# Altium project PCB_Project_1.PrjPcb
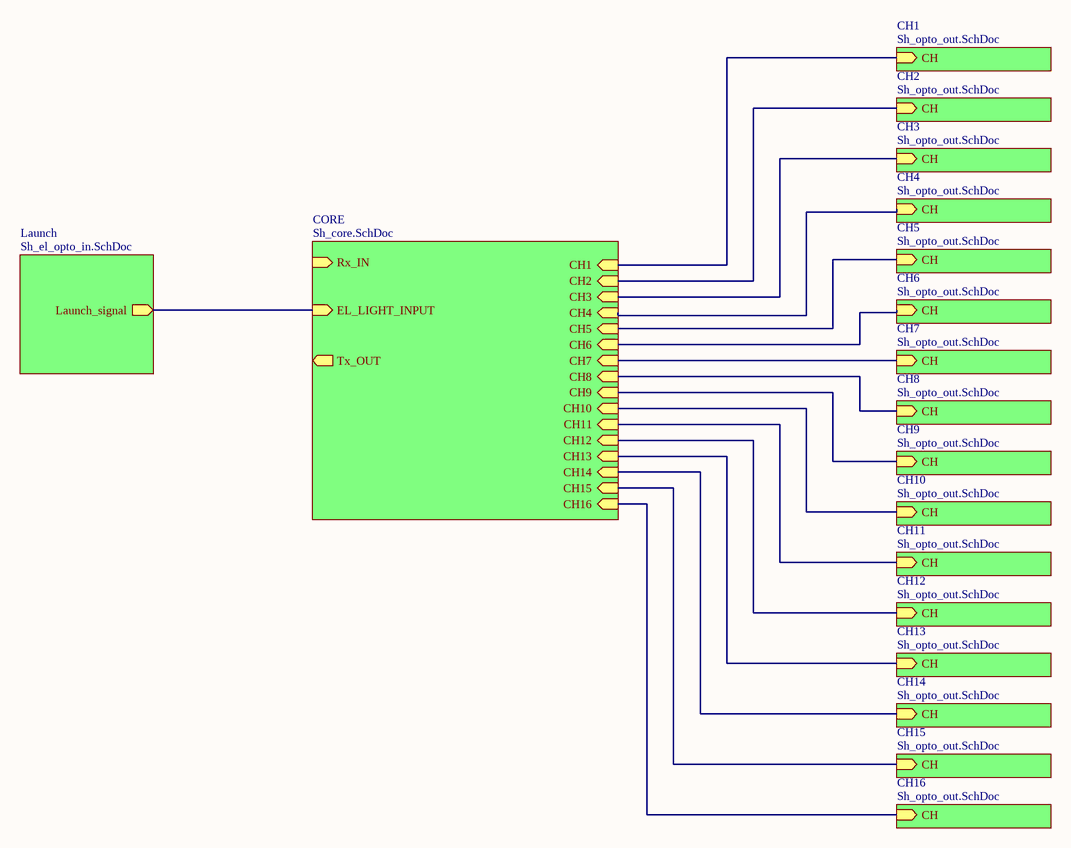
[diagram p0: Functional.SchDoc]
4 sheets, 127 parts. Net scope: hierarchical (ports join the sheet entries above them; power ports are global).
Board file: PCB2.PcbDoc
Sheets:
  Functional.SchDoc
    CORE = Sh_core.SchDoc
    CH1 = Sh_opto_out.SchDoc
    CH2 = Sh_opto_out.SchDoc
    CH3 = Sh_opto_out.SchDoc
    CH4 = Sh_opto_out.SchDoc
    CH5 = Sh_opto_out.SchDoc
    CH6 = Sh_opto_out.SchDoc
    CH7 = Sh_opto_out.SchDoc
    CH8 = Sh_opto_out.SchDoc
    CH9 = Sh_opto_out.SchDoc
    CH10 = Sh_opto_out.SchDoc
    CH11 = Sh_opto_out.SchDoc
    CH12 = Sh_opto_out.SchDoc
    CH13 = Sh_opto_out.SchDoc
    CH14 = Sh_opto_out.SchDoc
    CH15 = Sh_opto_out.SchDoc
    CH16 = Sh_opto_out.SchDoc
    Launch = Sh_el_opto_in.SchDoc

## Sheet Functional.SchDoc
size 420 x 297 mm; Address1: Address1; Address2: Address2; Address3: Address3; Address4: Address4; DocumentNumber: АБВГ.123456.001 Э3; SheetNumber: 1; Scale: 1:1; DocumentType: Схема электрическая принципиальная; FirstReferrence: АБВГ.123456.001

### Sub-sheets
CH1 = Sh_opto_out.SchDoc: CH (in)
CH2 = Sh_opto_out.SchDoc: CH (in)
CH3 = Sh_opto_out.SchDoc: CH (in)
CH4 = Sh_opto_out.SchDoc: CH (in)
CH5 = Sh_opto_out.SchDoc: CH (in)
CH6 = Sh_opto_out.SchDoc: CH (in)
CH7 = Sh_opto_out.SchDoc: CH (in)
CH8 = Sh_opto_out.SchDoc: CH (in)
CH9 = Sh_opto_out.SchDoc: CH (in)
CH10 = Sh_opto_out.SchDoc: CH (in)
CH11 = Sh_opto_out.SchDoc: CH (in)
CH12 = Sh_opto_out.SchDoc: CH (in)
CH13 = Sh_opto_out.SchDoc: CH (in)
CH14 = Sh_opto_out.SchDoc: CH (in)
CH15 = Sh_opto_out.SchDoc: CH (in)
CH16 = Sh_opto_out.SchDoc: CH (in)
CORE = Sh_core.SchDoc: CH1 (in), CH2 (in), CH3 (in), CH4 (in), CH5 (in), CH6 (in), CH7 (in), CH8 (in), CH9 (in), CH10 (in), CH11 (in), CH12 (in), CH13 (in), CH14 (in), CH15 (in), CH16 (in), Rx_IN (in), Tx_OUT (out), EL_LIGHT_INPUT (in)
Launch = Sh_el_opto_in.SchDoc: Launch_signal (out)

### Nets
NetD1_4: sheet CORE/EL_LIGHT_INPUT, sheet Launch/Launch_signal
NetR6_1: sheet CORE/CH16, sheet CH16/CH
NetR10_1: sheet CORE/CH15, sheet CH15/CH
NetR14_1: sheet CORE/CH14, sheet CH14/CH
NetR18_1: sheet CORE/CH13, sheet CH13/CH
NetR22_1: sheet CORE/CH12, sheet CH12/CH
NetR26_1: sheet CORE/CH11, sheet CH11/CH
NetR30_1: sheet CORE/CH10, sheet CH10/CH
NetR34_1: sheet CORE/CH9, sheet CH9/CH
NetR38_1: sheet CORE/CH8, sheet CH8/CH
NetR42_1: sheet CORE/CH7, sheet CH7/CH
NetR46_1: sheet CORE/CH6, sheet CH6/CH
NetR50_1: sheet CORE/CH5, sheet CH5/CH
NetR54_1: sheet CORE/CH4, sheet CH4/CH
NetR58_1: sheet CORE/CH3, sheet CH3/CH
NetR62_1: sheet CORE/CH2, sheet CH2/CH
NetR66_1: sheet CORE/CH1, sheet CH1/CH

### Notes on the sheet
- Перв. примен.
- Справ. №
- Подп. и дата
- Инв. № дубл.
- Взам. инв. №
- Разраб.
- Изм.
- Лист
- № докум.
- Подп.
- Дата
- Лит.
- Масса
- Масштаб
- Пров.
- Т.контр.
- Листов
- Инв. № подл.
- Утв.
- Н.контр.
- 2.106-A3
- Копировал
- Формат А3

## Sheet Sh_core.SchDoc
size 420 x 297 mm; Address1: Address1; Address2: Address2; Address3: Address3; Address4: Address4; DocumentNumber: АБВГ.123456.001 Э3; SheetNumber: 1; Scale: 1:1; DocumentType: Схема электрическая принципиальная; FirstReferrence: АБВГ.123456.001
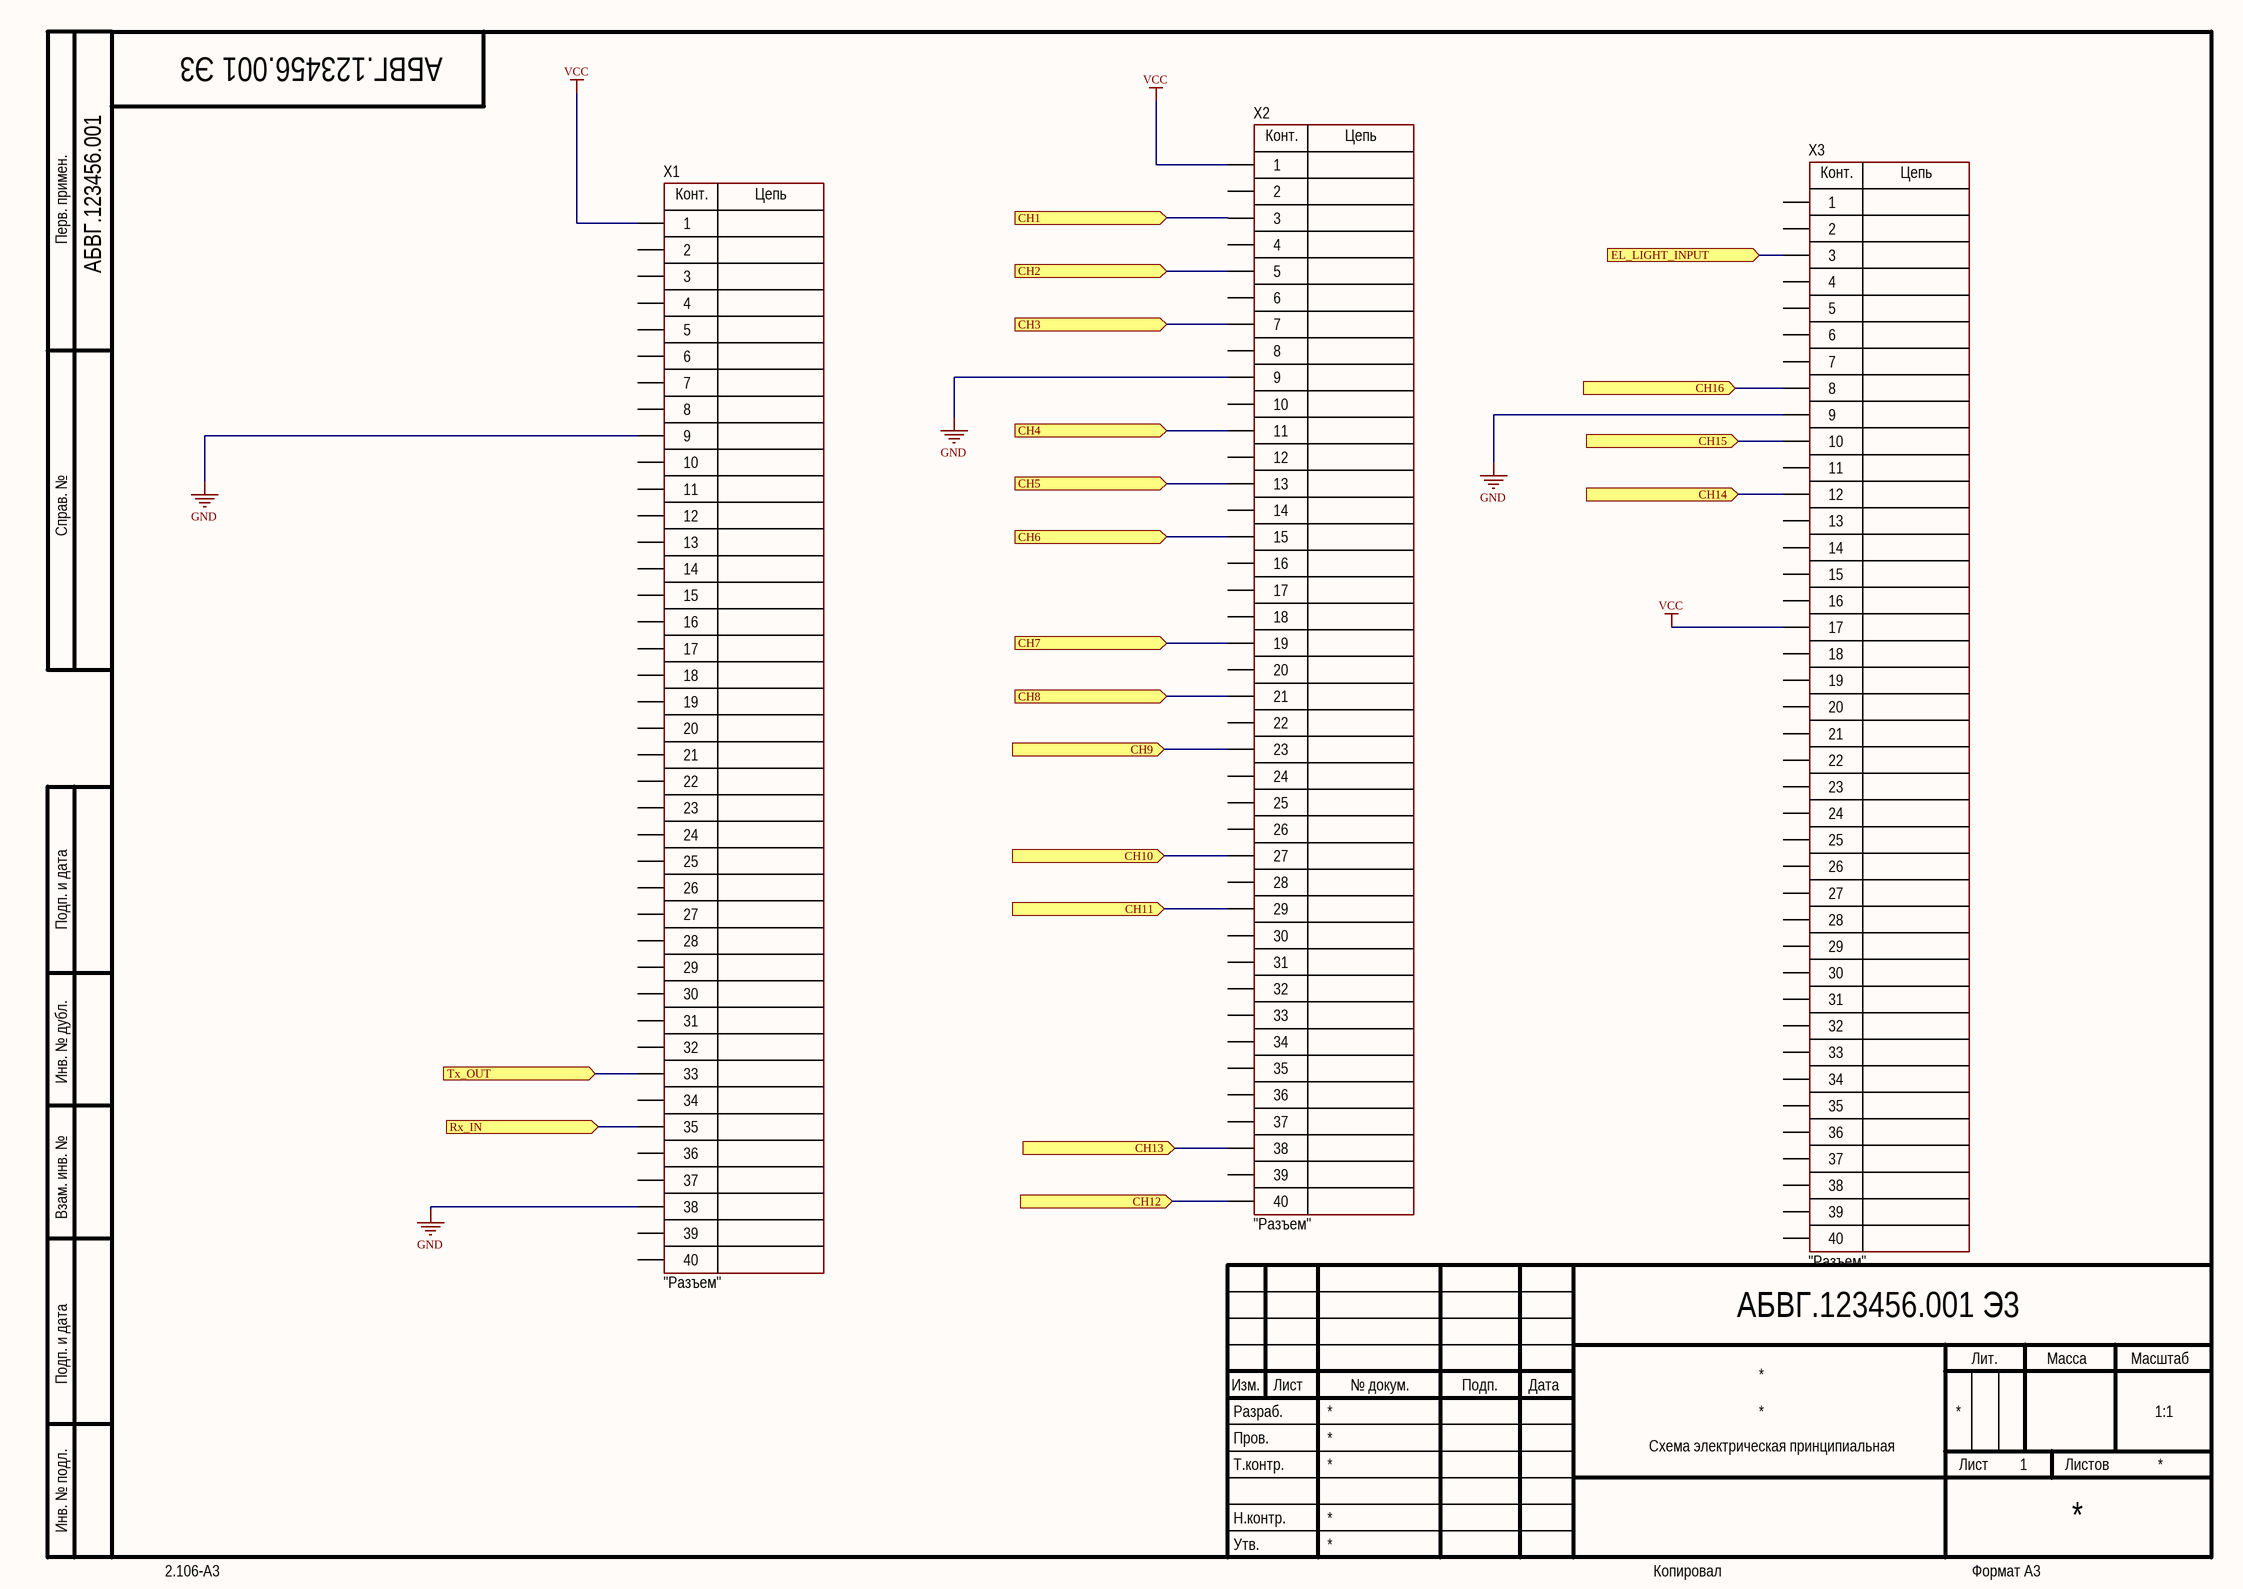
[diagram p1: Sh_core.SchDoc]

### Parts
X1  CommentText: "Разъем"  [CON: PBD-40 (2.54)]
X2  CommentText: "Разъем"  [CON: PBD-40 (2.54)]
X3  CommentText: "Разъем"  [CON: PBD-40 (2.54)]

### Ports
CH1 (in), CH2 (in), CH3 (in), CH4 (in), CH5 (in), CH6 (in), CH7 (in), CH8 (in), CH9 (in), CH10 (in), CH11 (in), CH12 (in), CH13 (in), CH14 (in), CH15 (in), CH16 (in), EL_LIGHT_INPUT (in), Rx_IN (in), Tx_OUT (in)

### Nets
GND: X1.9 X1.38 X2.9 X3.9
VCC: X1.1 X2.1 X3.17
NetD1_4: X3.3 ; port EL_LIGHT_INPUT
NetR6_1: X3.8 ; port CH16
NetR10_1: X3.10 ; port CH15
NetR14_1: X3.12 ; port CH14
NetR18_1: X2.38 ; port CH13
NetR22_1: X2.40 ; port CH12
NetR26_1: X2.29 ; port CH11
NetR30_1: X2.27 ; port CH10
NetR34_1: X2.23 ; port CH9
NetR38_1: X2.21 ; port CH8
NetR42_1: X2.19 ; port CH7
NetR46_1: X2.15 ; port CH6
NetR50_1: X2.13 ; port CH5
NetR54_1: X2.11 ; port CH4
NetR58_1: X2.7 ; port CH3
NetR62_1: X2.5 ; port CH2
NetR66_1: X2.3 ; port CH1
NetX1_33: X1.33 ; port Tx_OUT
NetX1_35: X1.35 ; port Rx_IN

Not connected (* = marked no-connect by the designer): X1 2 3 4 5 6 7 8 10 11 12 13 14 15 16 17 18 19 20 21 22 23 24 25 26 27 28 29 30 31 32 34 36 37 39 40; X2 2 4 6 8 10 12 14 16 17 18 20 22 24 25 26 28 30 31 32 33 34 35 36 37 39; X3 1 2 4 5 6 7 11 13 14 15 16 18 19 20 21 22 23 24 25 26 27 28 29 30 31 32 33 34 35 36 37 38 39 40

### Notes on the sheet
- Перв. примен.
- Справ. №
- Подп. и дата
- Инв. № дубл.
- Взам. инв. №
- Разраб.
- Изм.
- Лист
- № докум.
- Подп.
- Дата
- Лит.
- Масса
- Масштаб
- Пров.
- Т.контр.
- Листов
- Инв. № подл.
- Утв.
- Н.контр.
- 2.106-A3
- Копировал
- Формат А3
- (in symbol PBD-40) Конт.; Цепь

### Library data of the parts
X1-X3 = PBD-40: Manufacturer: Connfly; ValueManufacturerPartNumber: Connector, 20pin, 2.54mm, 500VAC, 3A; PartNumber: PLS-20; TypeConnector: Connector; VoltageMax: 500VAC; Pitch: 2.54mm; CurrentMax: 3A; Multichannel: 20pin; HelpURL: https://www.chipdip.ru/product/pls-20

## Sheet Sh_opto_out.SchDoc
size 420 x 297 mm; Address1: Address1; Address2: Address2; Address3: Address3; Address4: Address4; DocumentNumber: АБВГ.123456.001 Э3; SheetNumber: 1; Scale: 1:1; DocumentType: Схема электрическая принципиальная; FirstReferrence: АБВГ.123456.001
Used 16 times, as channels CH1, CH2, CH3, CH4, CH5, CH6, CH7, CH8, CH9, CH10, CH11, CH12, CH13, CH14, CH15, CH16. Parts and nets are listed once, with the designators drawn on the sheet.
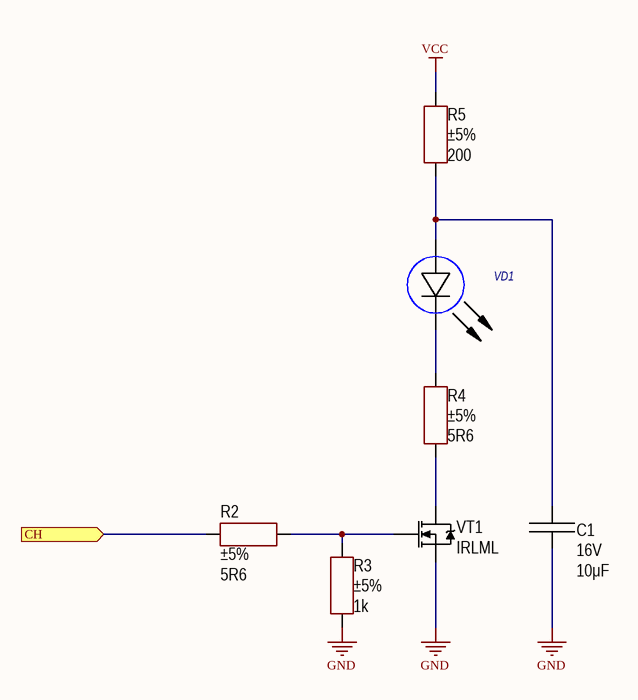
[diagram p2: Sh_opto_out.SchDoc]

### Parts
C1  value 10μF  Voltage: 16V  [CAP: 0805]
R2  value 5R6  Tolerance: ±5%  [RES: 1206]
R3  value 1k  Tolerance: ±5%  [RES: 0805]
R4  value 5R6  Tolerance: ±5%  [RES: 0805]
R5  value 200  Tolerance: ±5%  [RES: 0805]
VD1  SHF757  [LED: SFH757]  (value not drawn)
VT1  PartNumber: IRLML  [SOT23]

### Ports
CH (in)

### Nets
GND: C1.1 R3.1 VT1.2(S)
VCC: R5.2
CH: R2.1 ; port CH
NetC1_2: C1.2 R5.1 VD1.1(A)
NetR2_2: R2.2 R3.2 VT1.1(G)
NetR4_1: R4.1 VT1.3(D)
NetR4_2: R4.2 VD1.2(C)

### Channels
CH1: designators C1=C17 R2=R66 R3=R67 R4=R65 R5=R64 VD1=VD17 VT1=VT17; ports CH=NetR66_1
CH2: designators C1=C16 R2=R62 R3=R63 R4=R61 R5=R60 VD1=VD16 VT1=VT16; ports CH=NetR62_1
CH3: designators C1=C15 R2=R58 R3=R59 R4=R57 R5=R56 VD1=VD15 VT1=VT15; ports CH=NetR58_1
CH4: designators C1=C14 R2=R54 R3=R55 R4=R53 R5=R52 VD1=VD14 VT1=VT14; ports CH=NetR54_1
CH5: designators C1=C13 R2=R50 R3=R51 R4=R49 R5=R48 VD1=VD13 VT1=VT13; ports CH=NetR50_1
CH6: designators C1=C12 R2=R46 R3=R47 R4=R45 R5=R44 VD1=VD12 VT1=VT12; ports CH=NetR46_1
CH7: designators C1=C11 R2=R42 R3=R43 R4=R41 R5=R40 VD1=VD11 VT1=VT11; ports CH=NetR42_1
CH8: designators C1=C10 R2=R38 R3=R39 R4=R37 R5=R36 VD1=VD10 VT1=VT10; ports CH=NetR38_1
CH9: designators C1=C9 R2=R34 R3=R35 R4=R33 R5=R32 VD1=VD9 VT1=VT9; ports CH=NetR34_1
CH10: designators C1=C8 R2=R30 R3=R31 R4=R29 R5=R28 VD1=VD8 VT1=VT8; ports CH=NetR30_1
CH11: designators C1=C7 R2=R26 R3=R27 R4=R25 R5=R24 VD1=VD7 VT1=VT7; ports CH=NetR26_1
CH12: designators C1=C6 R2=R22 R3=R23 R4=R21 R5=R20 VD1=VD6 VT1=VT6; ports CH=NetR22_1
CH13: designators C1=C5 R2=R18 R3=R19 R4=R17 R5=R16 VD1=VD5 VT1=VT5; ports CH=NetR18_1
CH14: designators C1=C4 R2=R14 R3=R15 R4=R13 R5=R12 VD1=VD4 VT1=VT4; ports CH=NetR14_1
CH15: designators C1=C3 R2=R10 R3=R11 R4=R9 R5=R8 VD1=VD3 VT1=VT3; ports CH=NetR10_1
CH16: designators C1=C2#1 R2=R6 R3=R7 R4=R5#1 R5=R4#1 VD1=VD2#1 VT1=VT2#1; ports CH=NetR6_1

### Notes on the sheet
- Перв. примен.
- Справ. №
- Подп. и дата
- Инв. № дубл.
- Взам. инв. №
- Разраб.
- Изм.
- Лист
- № докум.
- Подп.
- Дата
- Лит.
- Масса
- Масштаб
- Пров.
- Т.контр.
- Листов
- Инв. № подл.
- Утв.
- Н.контр.
- 2.106-A3
- Копировал
- Формат А3

### Library data of the parts
C1 = Ceramic_0805: Manufacturer: Yageo; PartNumber: CC0805KRX7R7BB104; ValueManufacturerPartNumber: Ceramic capacitor, 10μF, X7R, ±10%, 16V, 0805, -55...+125°C; TypeCapacitor: Ceramic capacitor; Tolerance: ±10%; TypeDielectric: X7R; Package: 0805; HelpURL: https://www.digikey.com/product-detail/en/yageo/CC0805KRX7R7BB104/311-1142-1-ND/303052; Temperature: -55...+125°C
R2 = Resistor_1206: Manufacturer: Yageo; PartNumber: RC1206JR-07100RL; ValueManufacturerPartNumber: Resistor film, 5R6, ±5%, 1206, 0.25W, -55...+125°C; TypeResistor: Resistor film; Power: 0.25W; Package: 1206; HelpURL: https://www.digikey.com/product-detail/en/yageo/RC1206JR-07100RL/311-100ERCT-ND/732153; Temperature: -55...+125°C
R3 = Resistor_0805: Manufacturer: Yageo; PartNumber: RC0805JR-07100RL; ValueManufacturerPartNumber: Resistor film, 1k, ±5%, 0805, 0.125W, -55...+125°C; TypeResistor: Resistor film; Power: 0.125W; Package: 0805; HelpURL: https://www.digikey.com/product-detail/en/yageo/RC0805JR-07100RL/311-100ARCT-ND/731185; Temperature: -55...+125°C
R4 = Resistor_0805: Manufacturer: Yageo; PartNumber: RC0805JR-07100RL; ValueManufacturerPartNumber: Resistor film, 5R6, ±5%, 0805, 0.125W, -55...+125°C; TypeResistor: Resistor film; Power: 0.125W; Package: 0805; HelpURL: https://www.digikey.com/product-detail/en/yageo/RC0805JR-07100RL/311-100ARCT-ND/731185; Temperature: -55...+125°C
R5 = Resistor_0805: Manufacturer: Yageo; PartNumber: RC0805JR-07100RL; ValueManufacturerPartNumber: Resistor film, 200, ±5%, 0805, 0.125W, -55...+125°C; TypeResistor: Resistor film; Power: 0.125W; Package: 0805; HelpURL: https://www.digikey.com/product-detail/en/yageo/RC0805JR-07100RL/311-100ARCT-ND/731185; Temperature: -55...+125°C
VT1 = MOSFET_N_132: Manufacturer: Infineon Technologies; ValueManufacturerPartNumber: MOSFET N-channel transistor, 80V, 7A, 9.1nC, 2.5W, 34mOhm, 756pF, 8-TDSON, -55...+150°C; TypeTransistor: MOSFET N-channel transistor; VoltageDS: 80V; CurrentDS: 7A; RDS: 34mOhm; GateCharge: 9.1nC; InputCapacitor: 756pF; MaxPower: 2.5W; Package: 8-TDSON; HelpURL: https://www.digikey.com/product-detail/en/infineon-technologies/BSC340N08NS3GATMA1/BSC340N08NS3GATMA1TR-ND/2080655; Temperature: -55...+150°C
VD1 = SHF757: Model: *; Manufacture: *; HelpURL: *; Case: *

## Sheet Sh_el_opto_in.SchDoc
size 420 x 297 mm; Address1: Address1; Address2: Address2; Address3: Address3; Address4: Address4; DocumentNumber: АБВГ.123456.001 Э3; SheetNumber: 1; Scale: 1:1; DocumentType: Схема электрическая принципиальная; FirstReferrence: АБВГ.123456.001
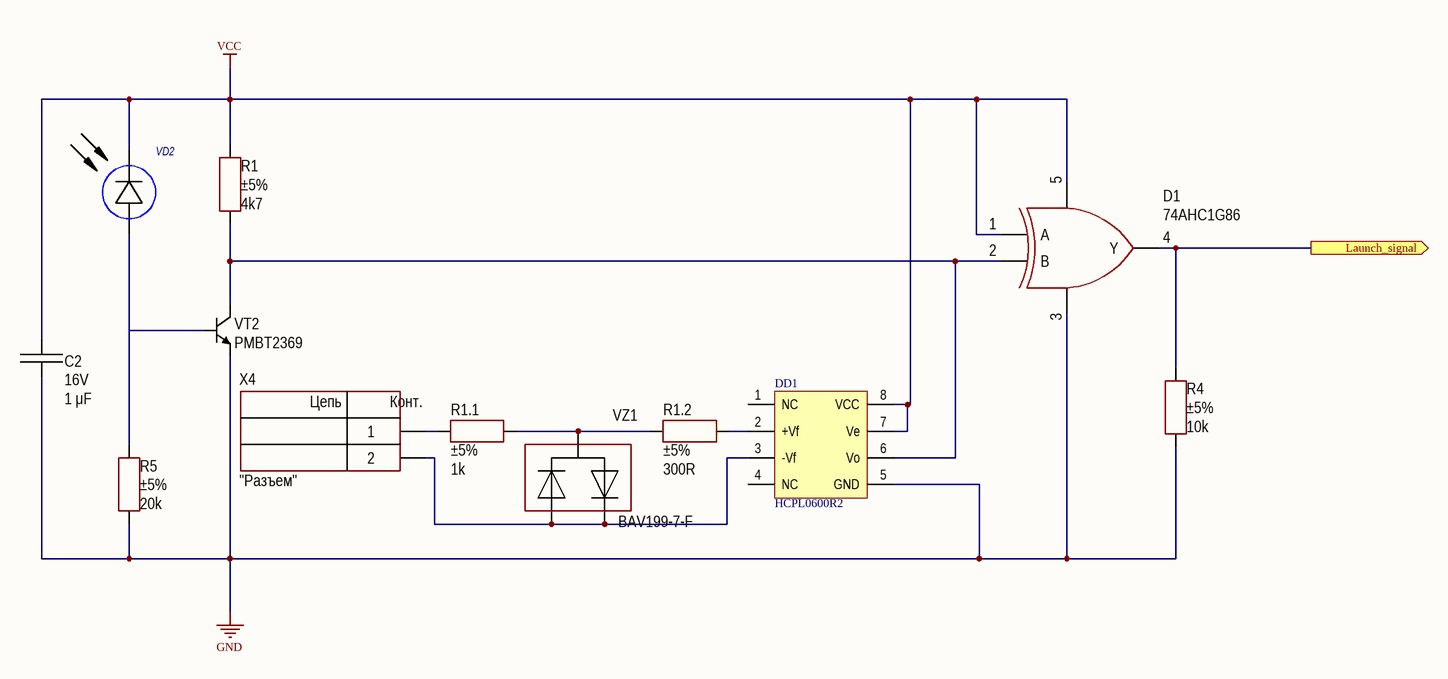
[diagram p3: Sh_el_opto_in.SchDoc]

### Parts
(Parts that share a designator on the sheet are numbered #1, #2 ... from top to bottom, then left to right.)
C2#2  value 1 μF  Voltage: 16V  [CAP: 0805]
D1  PartNumber: 74AHC1G86  [SOT23-5]
DD1  HCPL0600R2  [8-SOIC]
R1  value 4k7  Tolerance: ±5%  [RES: 0805]
R1.1  value 1k  Tolerance: ±5%  [RES: 0805]
R1.2  value 300R  Tolerance: ±5%  [RES: 0805]
R4#2  value 10k  Tolerance: ±5%  [RES: 0805]
R5#2  value 20k  Tolerance: ±5%  [RES: 0805]
VD2#2  SHF250  [LED: SFH757]  (value not drawn)
VT2#2  PartNumber: PMBT2369  [SOT23]
VZ1  PartNumber: BAV199-7-F  [SOT23]
X4  CommentText: "Разъем"  [CON: KF301-5.0-2P]

### Ports
Launch_signal (out)

### Nets
GND: C2#2.1 D1.3 DD1.5(GND) R4#2.1 R5#2.1 VT2#2.2(E)
VCC: C2#2.2 D1.1(A) D1.5 DD1.7(Ve) DD1.8(VCC) R1.2 VD2#2.2(C)
NetD1_2: D1.2(B) DD1.6(Vo) R1.1 VT2#2.3(C)
NetD1_4: D1.4(Y) R4#2.2 ; port Launch_signal
NetDD1_2: DD1.2(+Vf) R1.2.1
NetDD1_3: DD1.3(-Vf) VZ1.1 VZ1.2 X4.2
NetR1.1_1: R1.1.1 R1.2.2 VZ1.3
NetR1.1_2: R1.1.2 X4.1
NetR5#2_2: R5#2.2 VD2#2.1(A) VT2#2.1(B)

Not connected (* = marked no-connect by the designer): DD1 1(NC) 4(NC)

### Notes on the sheet
- Перв. примен.
- Справ. №
- Подп. и дата
- Инв. № дубл.
- Взам. инв. №
- Разраб.
- Изм.
- Лист
- № докум.
- Подп.
- Дата
- Лит.
- Масса
- Масштаб
- Пров.
- Т.контр.
- Листов
- Инв. № подл.
- Утв.
- Н.контр.
- 2.106-A3
- Копировал
- Формат А3
- (in symbol Connector_terminal_2pin) Цепь; Конт.

### Library data of the parts
C2#2 = Ceramic_0805: Manufacturer: Yageo; PartNumber: CC0805KRX7R7BB104; ValueManufacturerPartNumber: Ceramic capacitor, 1 μF, X7R, ±10%, 16V, 0805, -55...+125°C; TypeCapacitor: Ceramic capacitor; Tolerance: ±10%; TypeDielectric: X7R; Package: 0805; HelpURL: https://www.digikey.com/product-detail/en/yageo/CC0805KRX7R7BB104/311-1142-1-ND/303052; Temperature: -55...+125°C
D1 = SN74LVC1G86DBVR: XOR; Manufacturer: Texas Instruments; ValueManufacturerPartNumber: IC logic XOR, 1.65...5.5V, -40...+125°C, SOT23-5; Supply: 1.65...5.5V; HelpURL: https://www.digikey.com/product-detail/en/texas-instruments/SN74LVC1G86DBVR/296-9853-1-ND/380077; Package: SOT23-5; ComponentType: IC logic XOR; Temperature: -40...+125°C
R1 = Resistor_0805: Manufacturer: Yageo; PartNumber: RC0805JR-07100RL; ValueManufacturerPartNumber: Resistor film, 4k7, ±5%, 0805, 0.125W, -55...+125°C; TypeResistor: Resistor film; Power: 0.125W; Package: 0805; HelpURL: https://www.digikey.com/product-detail/en/yageo/RC0805JR-07100RL/311-100ARCT-ND/731185; Temperature: -55...+125°C
R1.1 = Resistor_0805: as R3 on sheet Sh_opto_out; Package: 0805; HelpURL: https://www.digikey.com/product-detail/en/yageo/RC0805JR-07100RL/311-100ARCT-ND/731185; Temperature: -55...+125°C
R1.2 = Resistor_0805: Manufacturer: Yageo; PartNumber: RC0805JR-07100RL; ValueManufacturerPartNumber: Resistor film, 300R, ±5%, 0805, 0.125W, -55...+125°C; TypeResistor: Resistor film; Power: 0.125W; Package: 0805; HelpURL: https://www.digikey.com/product-detail/en/yageo/RC0805JR-07100RL/311-100ARCT-ND/731185; Temperature: -55...+125°C
R4#2 = Resistor_0805: Manufacturer: Yageo; PartNumber: RC0805JR-07100RL; ValueManufacturerPartNumber: Resistor film, 10k, ±5%, 0805, 0.125W, -55...+125°C; TypeResistor: Resistor film; Power: 0.125W; Package: 0805; HelpURL: https://www.digikey.com/product-detail/en/yageo/RC0805JR-07100RL/311-100ARCT-ND/731185; Temperature: -55...+125°C
R5#2 = Resistor_0805: Manufacturer: Yageo; PartNumber: RC0805JR-07100RL; ValueManufacturerPartNumber: Resistor film, 20k, ±5%, 0805, 0.125W, -55...+125°C; TypeResistor: Resistor film; Power: 0.125W; Package: 0805; HelpURL: https://www.digikey.com/product-detail/en/yageo/RC0805JR-07100RL/311-100ARCT-ND/731185; Temperature: -55...+125°C
VT2#2 = BJT_NPN_132: Manufacturer: ON Semiconductor; ValueManufacturerPartNumber: NPN transistor, 45V, 100mA, 100MHz, 300mW, 0.6V, 420, SOT-23, -55...+125°C; TypeTransistor: NPN transistor; VoltageCE: 45V; CurrentCE: 100mA; VoltageSaturation: 0.6V; Frequency: 100MHz; CurrentGain: 420; MaxPower: 300mW; Package: SOT-23; HelpURL: https://www.digikey.com/product-detail/en/on-semiconductor/BC847CLT1G/BC847CLT1GOSCT-ND/917836; Temperature: -55...+125°C
VZ1 = Diode_array: Manufacturer: Diodes Incorporated; ValueManufacturerPartNumber: Diode array, 85V, 140mA, 1.1V, 3us, SOT-23, -65...+150°C; TypeDiode: Diode array; Voltage: 85V; Current: 140mA; VoltageDrop: 1.1V; RecoveryTime: 3us; Package: SOT-23; HelpURL: https://www.digikey.com/product-detail/en/diodes-incorporated/BAV199-7-F/BAV199-FDICT-ND/1033647; Temperature: -65...+150°C
X4 = Connector_terminal_2pin: Manufacturer: Degson; ValueManufacturerPartNumber: Terminal connector, 2pin, 3.5mm, 300VAC, 10A; PartNumber: DG350-3.5-02P-14; TypeConnector: Terminal connector; VoltageMax: 300VAC; Pitch: 3.5mm; CurrentMax: 10A; Multichannel: 2pin; HelpURL: https://www.chipdip.ru/product/dg350-3.5-02p-12
VD2 = SHF250: Model: *; Manufacture: *; HelpURL: *; Case: *

## Nets that join several sheets
GND: Sh_core (X1.9 X1.38 X2.9 X3.9), CH1 (C17.1 R67.1 VT17.2), CH2 (C16.1 R63.1 VT16.2), CH3 (C15.1 R59.1 VT15.2), CH4 (C14.1 R55.1 VT14.2), CH5 (C13.1 R51.1 VT13.2), CH6 (C12.1 R47.1 VT12.2), CH7 (C11.1 R43.1 VT11.2), CH8 (C10.1 R39.1 VT10.2), CH9 (C9.1 R35.1 VT9.2), CH10 (C8.1 R31.1 VT8.2), CH11 (C7.1 R27.1 VT7.2), CH12 (C6.1 R23.1 VT6.2), CH13 (C5.1 R19.1 VT5.2), CH14 (C4.1 R15.1 VT4.2), CH15 (C3.1 R11.1 VT3.2), CH16 (C2#1.1 R7.1 VT2#1.2), Sh_el_opto_in (6 pins)
VCC: Sh_core (X1.1 X2.1 X3.17), CH1 (R64.2), CH2 (R60.2), CH3 (R56.2), CH4 (R52.2), CH5 (R48.2), CH6 (R44.2), CH7 (R40.2), CH8 (R36.2), CH9 (R32.2), CH10 (R28.2), CH11 (R24.2), CH12 (R20.2), CH13 (R16.2), CH14 (R12.2), CH15 (R8.2), CH16 (R4#1.2), Sh_el_opto_in (7 pins)
NetD1_4: Sh_core (X3.3), Sh_el_opto_in (D1.4 R4#2.2)
NetR6_1: Sh_core (X3.8), CH16 (R6.1)
NetR10_1: Sh_core (X3.10), CH15 (R10.1)
NetR14_1: Sh_core (X3.12), CH14 (R14.1)
NetR18_1: Sh_core (X2.38), CH13 (R18.1)
NetR22_1: Sh_core (X2.40), CH12 (R22.1)
NetR26_1: Sh_core (X2.29), CH11 (R26.1)
NetR30_1: Sh_core (X2.27), CH10 (R30.1)
NetR34_1: Sh_core (X2.23), CH9 (R34.1)
NetR38_1: Sh_core (X2.21), CH8 (R38.1)
NetR42_1: Sh_core (X2.19), CH7 (R42.1)
NetR46_1: Sh_core (X2.15), CH6 (R46.1)
NetR50_1: Sh_core (X2.13), CH5 (R50.1)
NetR54_1: Sh_core (X2.11), CH4 (R54.1)
NetR58_1: Sh_core (X2.7), CH3 (R58.1)
NetR62_1: Sh_core (X2.5), CH2 (R62.1)
NetR66_1: Sh_core (X2.3), CH1 (R66.1)